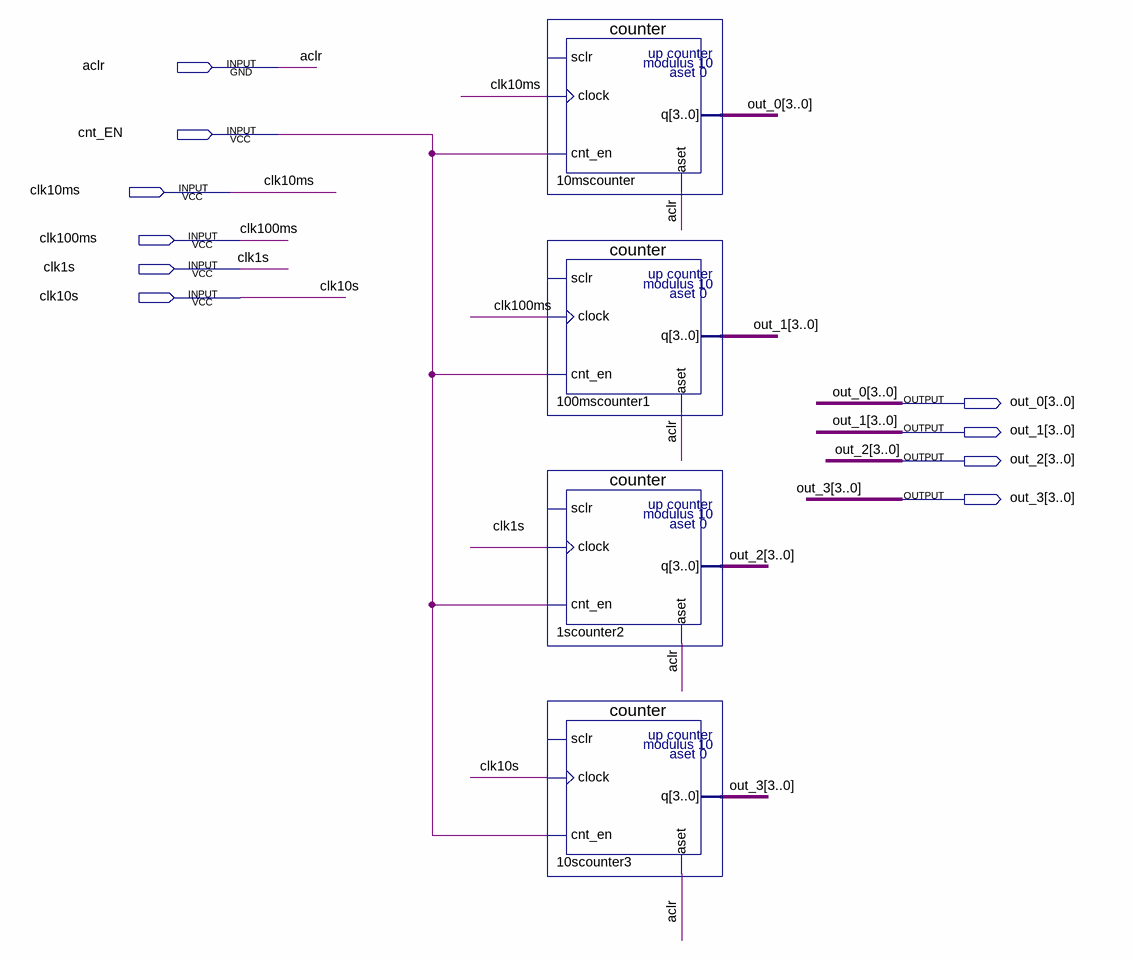
[diagram p0: schematic sheet]
// Quartus schematic counters2.bdf as structural Verilog: 4 symbols, 10 pins
module counters2 (
  input  aclr,
  input  cnt_EN,
  input  clk10ms,
  input  clk100ms,
  input  clk1s,
  input  clk10s,
  output [3:0] out_0,
  output [3:0] out_1,
  output [3:0] out_2,
  output [3:0] out_3
);

  counter u_10mscounter (.clock(clk10ms), .cnt_en(cnt_EN), .aset(aclr), .q(out_0));  // open: sclr
  counter u_100mscounter1 (.clock(clk100ms), .cnt_en(cnt_EN), .aset(aclr), .q(out_1));  // open: sclr
  counter u_1scounter2 (.clock(clk1s), .cnt_en(cnt_EN), .aset(aclr), .q(out_2));  // open: sclr
  counter u_10scounter3 (.clock(clk10s), .cnt_en(cnt_EN), .aset(aclr), .q(out_3));  // open: sclr
endmodule
